# Altium schematic sheet SurfaceControlSystem_RevA.SchDoc
size A3; _PRJ_TITLE: PROJECT TITLE; _SHT_TITLE: Sheet; _REV: A; PageSetup: Record=PageOptions|CenterHorizontal=True|CenterVertical=True|PrintScale=0.71|XCorrection=1.00|YCorrection=1.00|PrintKind=0|BorderSize=5000000|LeftOffset=0|BottomOffset=0|Orientation=2|PaperLength=1000|PaperWidth=1000|Scale=100|PaperSource=258|PrintQuality=600|MediaType=1|DitherType=10|PaperKind=A3 (297x420mm)|PrintScaleMode=1
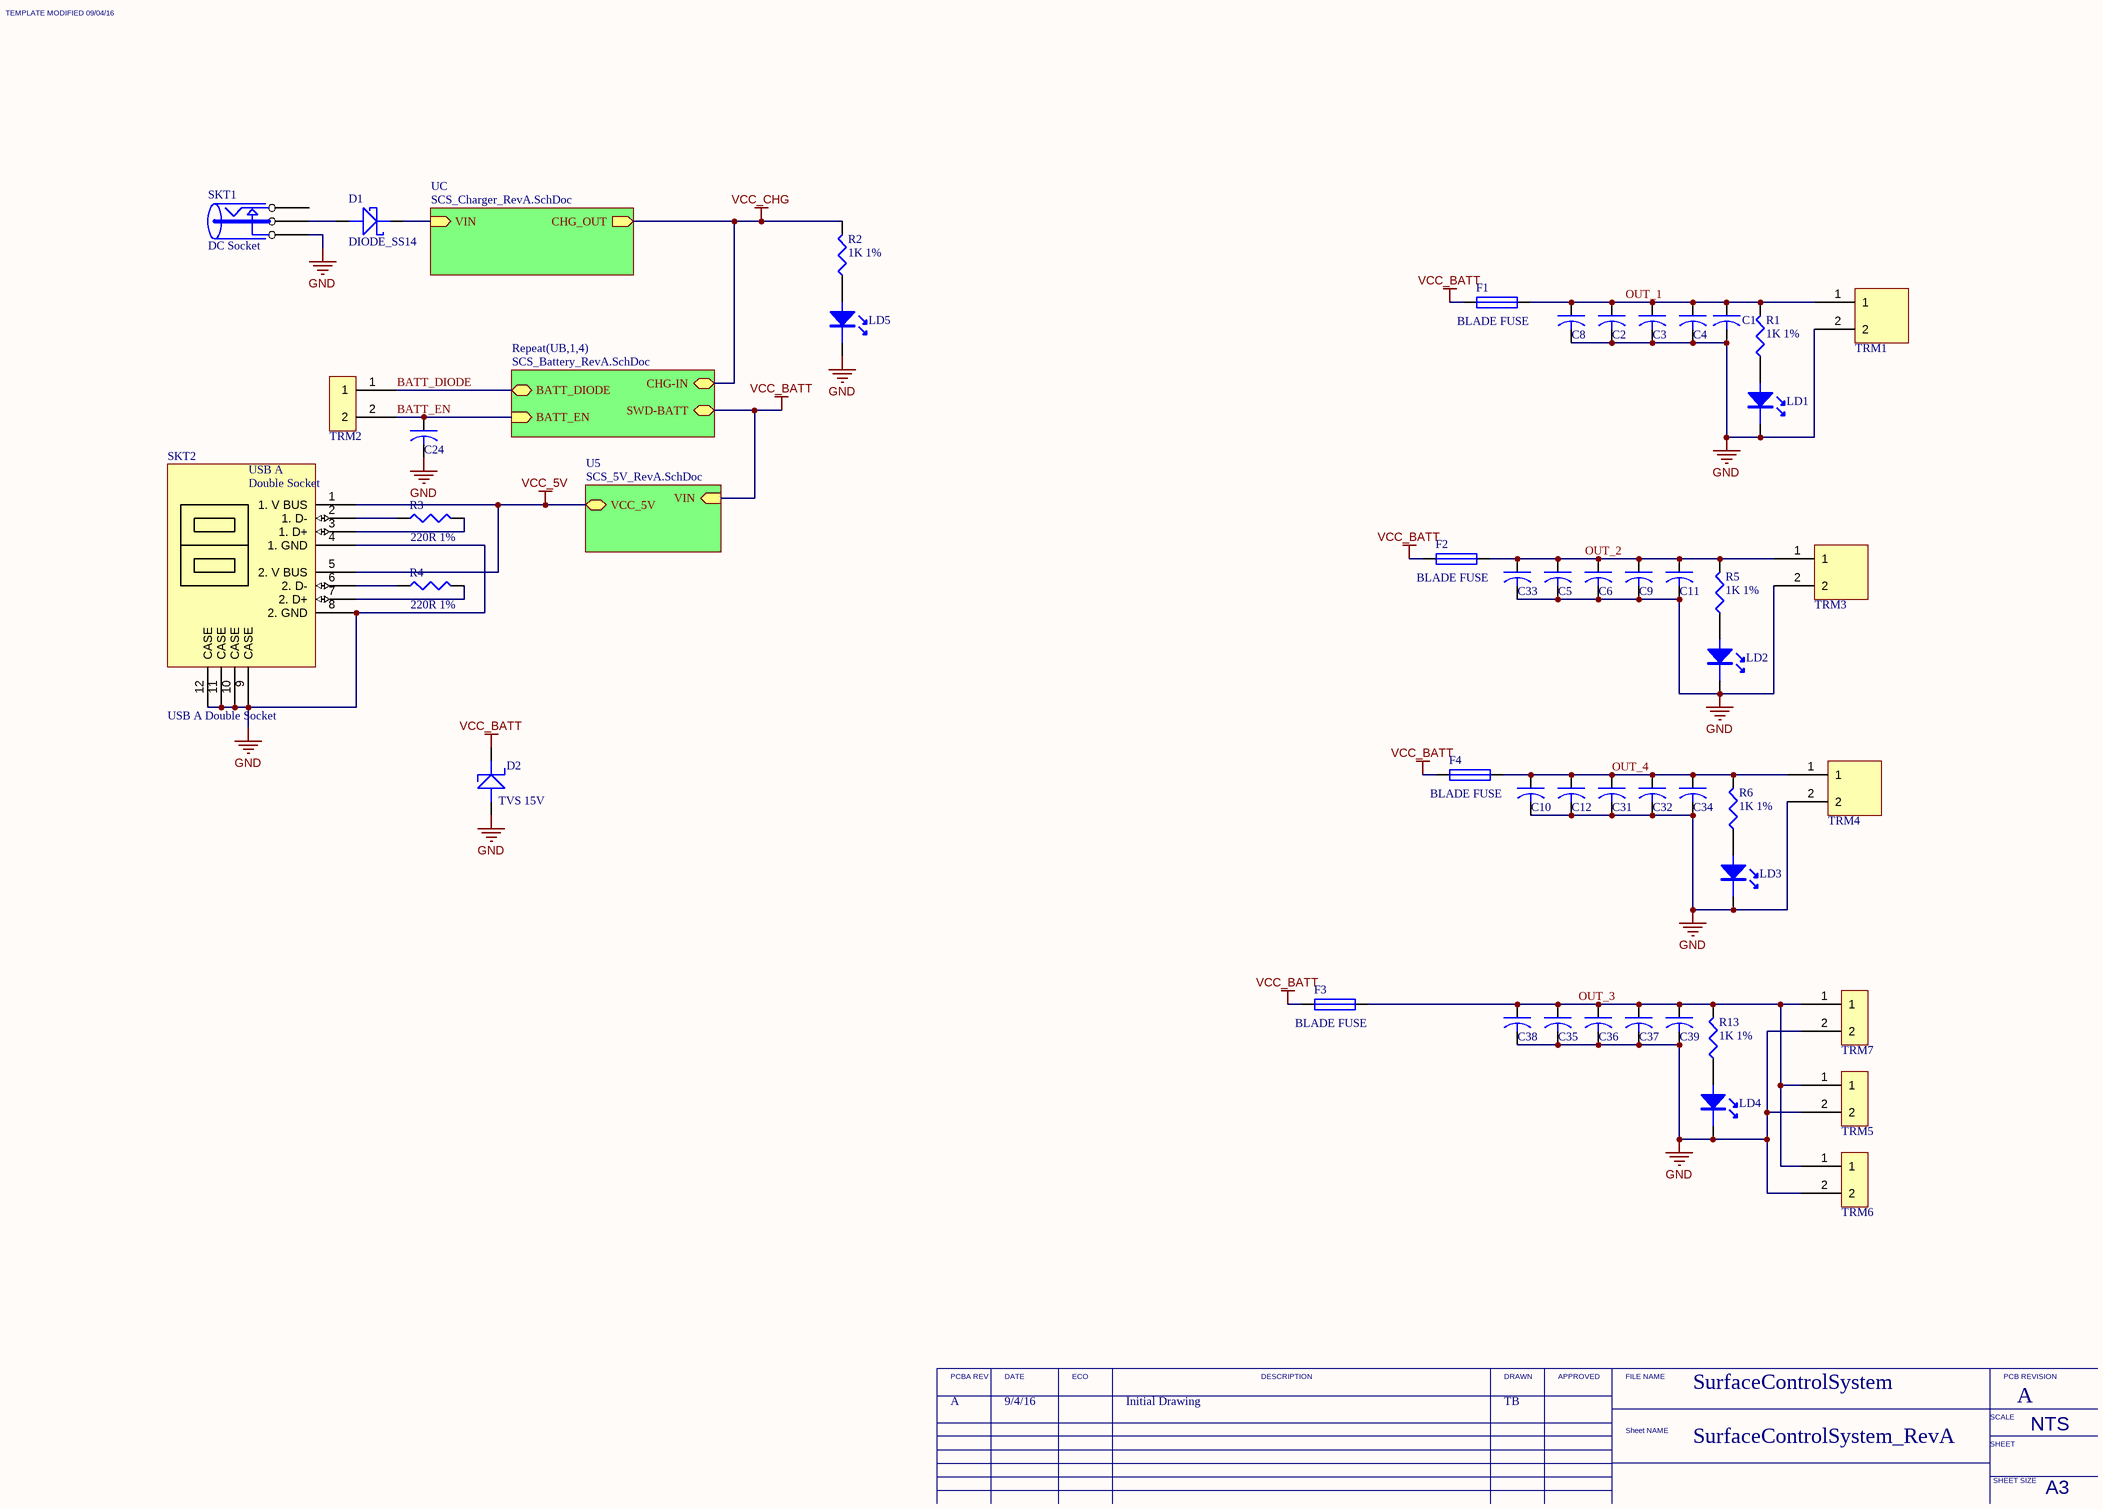
[diagram p0: SurfaceControlSystem_RevA.SchDoc]

## Parts
C1  10UF 25V  [1206]  (value not drawn)
C2  10UF 25V  [1206]  (value not drawn)
C3  10UF 25V  [1206]  (value not drawn)
C4  10UF 25V  [1206]  (value not drawn)
C5  10UF 25V  [1206]  (value not drawn)
C6  10UF 25V  [1206]  (value not drawn)
C8  100nF 50V  [0603]  (value not drawn)
C9  10UF 25V  [1206]  (value not drawn)
C10  100nF 50V  [0603]  (value not drawn)
C11  10UF 25V  [1206]  (value not drawn)
C12  10UF 25V  [1206]  (value not drawn)
C24  100nF 50V  [0603]  (value not drawn)
C31  10UF 25V  [1206]  (value not drawn)
C32  10UF 25V  [1206]  (value not drawn)
C33  100nF 50V  [0603]  (value not drawn)
C34  10UF 25V  [1206]  (value not drawn)
C35  10UF 25V  [1206]  (value not drawn)
C36  10UF 25V  [1206]  (value not drawn)
C37  10UF 25V  [1206]  (value not drawn)
C38  100nF 50V  [0603]  (value not drawn)
C39  10UF 25V  [1206]  (value not drawn)
D1  DIODE_SS14  [DO-214AC]
D2  TVS 15V  [DO-214AB]
F1  BLADE FUSE  [FUSEHOLDER_BLADE]
F2  BLADE FUSE  [FUSEHOLDER_BLADE]
F3  BLADE FUSE  [FUSEHOLDER_BLADE]
F4  BLADE FUSE  [FUSEHOLDER_BLADE]
LD1  Green LED 0805  [0805DIODE]  (value not drawn)
LD2  Green LED 0805  [0805DIODE]  (value not drawn)
LD3  Green LED 0805  [0805DIODE]  (value not drawn)
LD4  Green LED 0805  [0805DIODE]  (value not drawn)
LD5  Green LED 0805  [0805DIODE]  (value not drawn)
R1  1K 1%  [0603]
R2  1K 1%  [0603]
R3  220R 1%  [0603]
R4  220R 1%  [0603]
R5  1K 1%  [0603]
R6  1K 1%  [0603]
R13  1K 1%  [0603]
SKT1  DC Socket  [SKT_PWR]
SKT2  USB A Double Socket  [USB_A_DoubleSocket]
TRM1  2way screw terminal, High current  [TERM_2POS_HORIZ_7.62MM]  (value not drawn)
TRM2  Wurth 2way screw terminal  [TERM_2POS_HORIZ_5.08MM]  (value not drawn)
TRM3  2way screw terminal, High current  [TERM_2POS_HORIZ_7.62MM]  (value not drawn)
TRM4  2way screw terminal, High current  [TERM_2POS_HORIZ_7.62MM]  (value not drawn)
TRM5  Wurth 2way screw terminal  [TERM_2POS_HORIZ_5.08MM]  (value not drawn)
TRM6  Wurth 2way screw terminal  [TERM_2POS_HORIZ_5.08MM]  (value not drawn)
TRM7  Wurth 2way screw terminal  [TERM_2POS_HORIZ_5.08MM]  (value not drawn)

## Sub-sheets
Repeat(UB,1,4) = SCS_Battery_RevA.SchDoc: SWD-BATT (bidir), CHG-IN (bidir), BATT_EN (in), BATT_DIODE (bidir)
U5 = SCS_5V_RevA.SchDoc: VIN (in), VCC_5V (bidir)
UC = SCS_Charger_RevA.SchDoc: VIN (in), CHG_OUT (out)

## Nets
GND: C1.2 C2.2 C3.2 C4.2 C5.2 C6.2 C8.2 C9.2 C10.2 C11.2 C12.2 C24.2 C31.2 C32.2 C33.2 C34.2 C35.2 C36.2 C37.2 C38.2 C39.2 D2.A LD1.K LD2.K LD3.K LD4.K LD5.K SKT1.SW SKT2.4(1._GND) SKT2.8(2._GND) SKT2.9(CASE) SKT2.10(CASE) SKT2.11(CASE) SKT2.12(CASE) TRM1.2 TRM3.2 TRM4.2 TRM5.2 TRM6.2 TRM7.2
VCC_5V: SKT2.1(1._V_BUS) SKT2.5(2._V_BUS) ; sheet U5/VCC_5V
VCC_BATT: D2.K F1.1 F2.1 F3.1 F4.1 ; sheet Repeat(UB,1,4)/SWD-BATT, sheet U5/VIN
VCC_CHG: R2.2 ; sheet Repeat(UB,1,4)/CHG-IN, sheet UC/CHG_OUT
BATT_DIODE: TRM2.1 ; sheet Repeat(UB,1,4)/BATT_DIODE
BATT_EN: C24.1 TRM2.2 ; sheet Repeat(UB,1,4)/BATT_EN
OUT_1: C1.1 C2.1 C3.1 C4.1 C8.1 F1.2 R1.2 TRM1.1
OUT_2: C5.1 C6.1 C9.1 C11.1 C33.1 F2.2 R5.2 TRM3.1
OUT_3: C35.1 C36.1 C37.1 C38.1 C39.1 F3.2 R13.2 TRM5.1 TRM6.1 TRM7.1
OUT_4: C10.1 C12.1 C31.1 C32.1 C34.1 F4.2 R6.2 TRM4.1
NetD1_A: D1.A SKT1.PIN
NetD1_K: D1.K ; sheet UC/VIN
NetLD1_A: LD1.A R1.1
NetLD2_A: LD2.A R5.1
NetLD3_A: LD3.A R6.1
NetLD4_A: LD4.A R13.1
NetLD5_A: LD5.A R2.1
NetR3_1: R3.1 SKT2.3(1._D+)
NetR3_2: R3.2 SKT2.2(1._D-)
NetR4_1: R4.1 SKT2.7(2._D+)
NetR4_2: R4.2 SKT2.6(2._D-)

Not connected (* = marked no-connect by the designer): SKT1 COM

## Notes on the sheet
- SurfaceControlSystem
- A
- 9/4/16
- Initial Drawing
- TB
- SurfaceControlSystem_RevA
- TEMPLATE MODIFIED 09/04/16
- PCBA REV
- DATE
- ECO
- DESCRIPTION
- DRAWN
- APPROVED
- FILE NAME
- PCB REVISION
- Sheet NAME
- SCALE
- SHEET
- NTS
- SHEET SIZE
- A3
- (in symbol USB_A_Double) USB A; Double Socket

## Library data of the parts
C1-C6 C9 C11 C12 C31 C32 C34-C37 C39 = CAP_10UF_25V_10%_1206: CAP CER 10UF 25V 10% X5R 1206; Manufacturer: Murata; Manufacturer P/N: GRM319R61E106KA12D
C8 C10 C24 C33 C38 = CAP_100NF_50V_10%_0603: CAP CER 100nF 50V 10% X7R 0603; Manufacturer: Murata; Manufacturer P/N: GRM188R71H104KA93D
D1 = DIODE_SS14: Schottky Diode, 1A, 40V SS14; Manufacturer: Fairchild; Manufacturer P/N: SS14
D2 = DIODE_TVS_SMCJ15A: TVS Diode, 15V; Manufacturer: LIttlefuse; Manufacturer P/N: SMCJ15A
F1-F4 = FUSE_BLADE_500V_30A_PCB: FUSE CLIP BLADE 500V 30A PCB; Manufacturer: Keystone Electronics; Manufacturer P/N: 3522-2
LD1-LD5 = LED_Green_0805: WL-SMCW SMD CHIP LED WATERCLEAR; Manufacturer: Wurth; Manufacturer P/N: 150080VS75000
R1 R2 R5 R6 R13 = RES_1K_1%_0603: Resistor, 1K, 1%, 0603; Manufacturer: Bourns Inc; Manufacturer P/N: CR0603-FX-1001ELF
R3 R4 = RES_220R_1%_0603: Resistor, 220R, 1%, 0603; Manufacturer: Bourns Inc; Manufacturer P/N: CR0603-FX-2200ELF
SKT1 = SOCKET_DC: Manufacturer: N/A; Manufacturer P/N: N/A
SKT2 = USB_A_Double: PartNo: P1301; Supplier: Altronics
TRM1 TRM3 TRM4 = TRM_2way_ScrewTerminal_7.62mm: TERM BLOCK 2POS HORIZ 7.62MM T/H; Manufacturer: Altronics; Manufacturer P/N: P4343
TRM2 TRM5-TRM7 = TRM_2way_ScrewTerminal: TERM BLOCK 2POS HORIZ 5.08MM T/H; Manufacturer: Wurth Electronics Inc; Manufacturer P/N: 691216510002